# Altium schematic sheet ripple_carry_counter.SchDoc
size A4
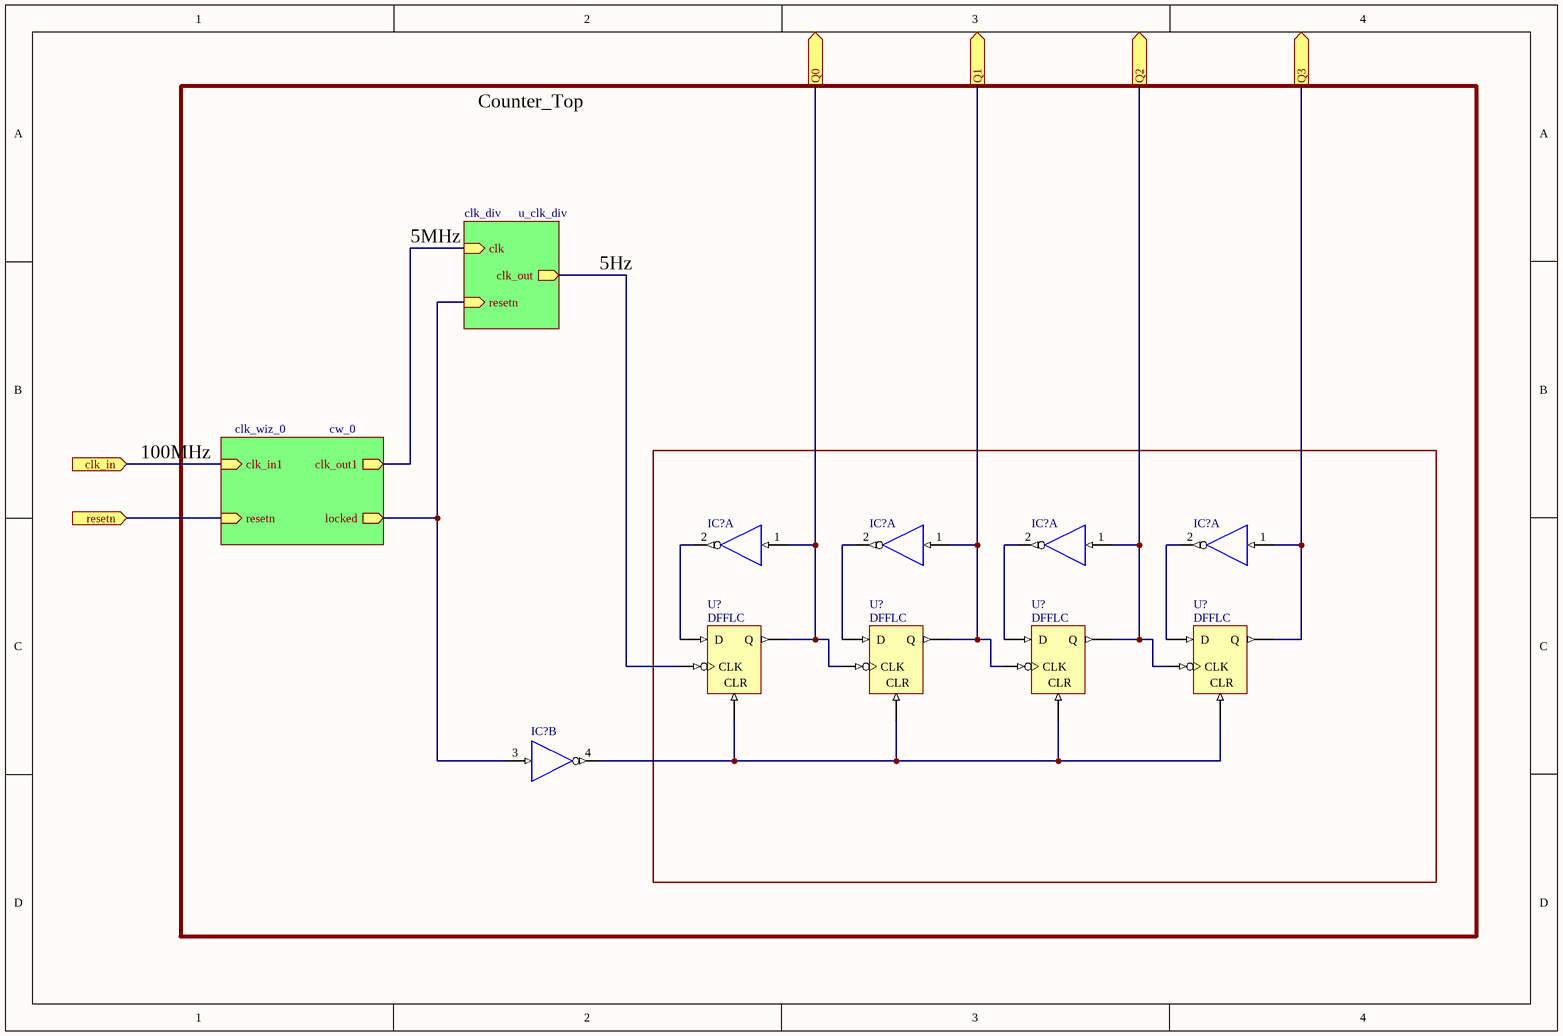
[diagram p0: ripple_carry_counter.SchDoc]

## Parts
(Parts that share a designator on the sheet are numbered #1, #2 ... from top to bottom, then left to right.)
IC?#1  SN7404N  [N014]  (value not drawn)  (part A of 6)
IC?#2  SN7404N  [N014]  (value not drawn)  (part A of 6)
IC?#3  SN7404N  [N014]  (value not drawn)  (part A of 6)
IC?#4  SN7404N  [N014]  (value not drawn)  (part A of 6)
IC?#5  SN7404N  [N014]  (value not drawn)  (part B of 6)
U?#1  DFFLC
U?#2  DFFLC
U?#3  DFFLC
U?#4  DFFLC

## Sub-sheets
clk_div = u_clk_div: clk (in), resetn (in), clk_out (out)
cw_0 = clk_wiz_0: clk_in1 (in), resetn (in), clk_out1 (out), locked (out)

## Ports
clk_in (in), Q0 (out), Q1 (out), Q2 (out), Q3 (out), resetn (in)

## Nets
GND: IC?#1.7(GND) IC?#2.7(GND) IC?#3.7(GND) IC?#4.7(GND) IC?#5.7(GND)
VCC: IC?#1.14(VCC) IC?#2.14(VCC) IC?#3.14(VCC) IC?#4.14(VCC) IC?#5.14(VCC)
clk_in: port clk_in, sheet cw_0/clk_in1
Q0: IC?#1.1(A) U?#1.Q U?#2.CLK ; port Q0
Q1: IC?#2.1(A) U?#2.Q U?#3.CLK ; port Q1
Q2: IC?#3.1(A) U?#3.Q U?#4.CLK ; port Q2
Q3: IC?#4.1(A) U?#4.Q ; port Q3
resetn: port resetn, sheet cw_0/resetn
NetIC?#1_2: IC?#1.2(Y) U?#1.D
NetIC?#2_2: IC?#2.2(Y) U?#2.D
NetIC?#3_2: IC?#3.2(Y) U?#3.D
NetIC?#4_2: IC?#4.2(Y) U?#4.D
NetIC?#5_3: IC?#5.3(A) ; sheet cw_0/locked, sheet clk_div/resetn
NetIC?#5_4: IC?#5.4(Y) U?#1.CLR U?#2.CLR U?#3.CLR U?#4.CLR
NetU?#1_CLK: U?#1.CLK ; sheet clk_div/clk_out
(unnamed): sheet cw_0/clk_out1, sheet clk_div/clk

## Notes on the sheet
- Counter_Top
- 5MHz
- 5Hz
- 100MHz

## Library data of the parts
IC?#1-IC?#5 = SN7404N: Hex Inverter; Published: 8-Jun-2000; LatestRevisionDate: 04-Mar-2005; LatestRevisionNote: Stylized 3D Model Added.; DatasheetVersion: Mar-1988; PackageVersion: Oct-1995; PackageReference: N014; Publisher: Altium Limited; PackageDescription: DIP; 14 Leads; Row Spacing 7.62 mm; Pitch 2.54 mm; ComponentLink1Description: Manufacturer Link; ComponentLink1URL: http://www.ti.com/; ComponentLink2Description: Datasheet; ComponentLink2URL: http://www-s.ti.com/sc/ds/sn5404.pdf; ComponentLink3Description: Packaging Specification; ComponentLink3URL: http://focus.ti.com/lit/ml/mpdi002c/mpdi002c.pdf
U?#1-U?#4 = DFFLC: Negative Edge Triggered D-Type Flip-Flop with Active High Clear; FPGAVendor: Actel; Published: 21-Jul-2004; Publisher: Altium Limited; HelpURL: http://www.actel.com/documents/PA_libguide.pdf